# Altium project NixieClock.PrjPcb
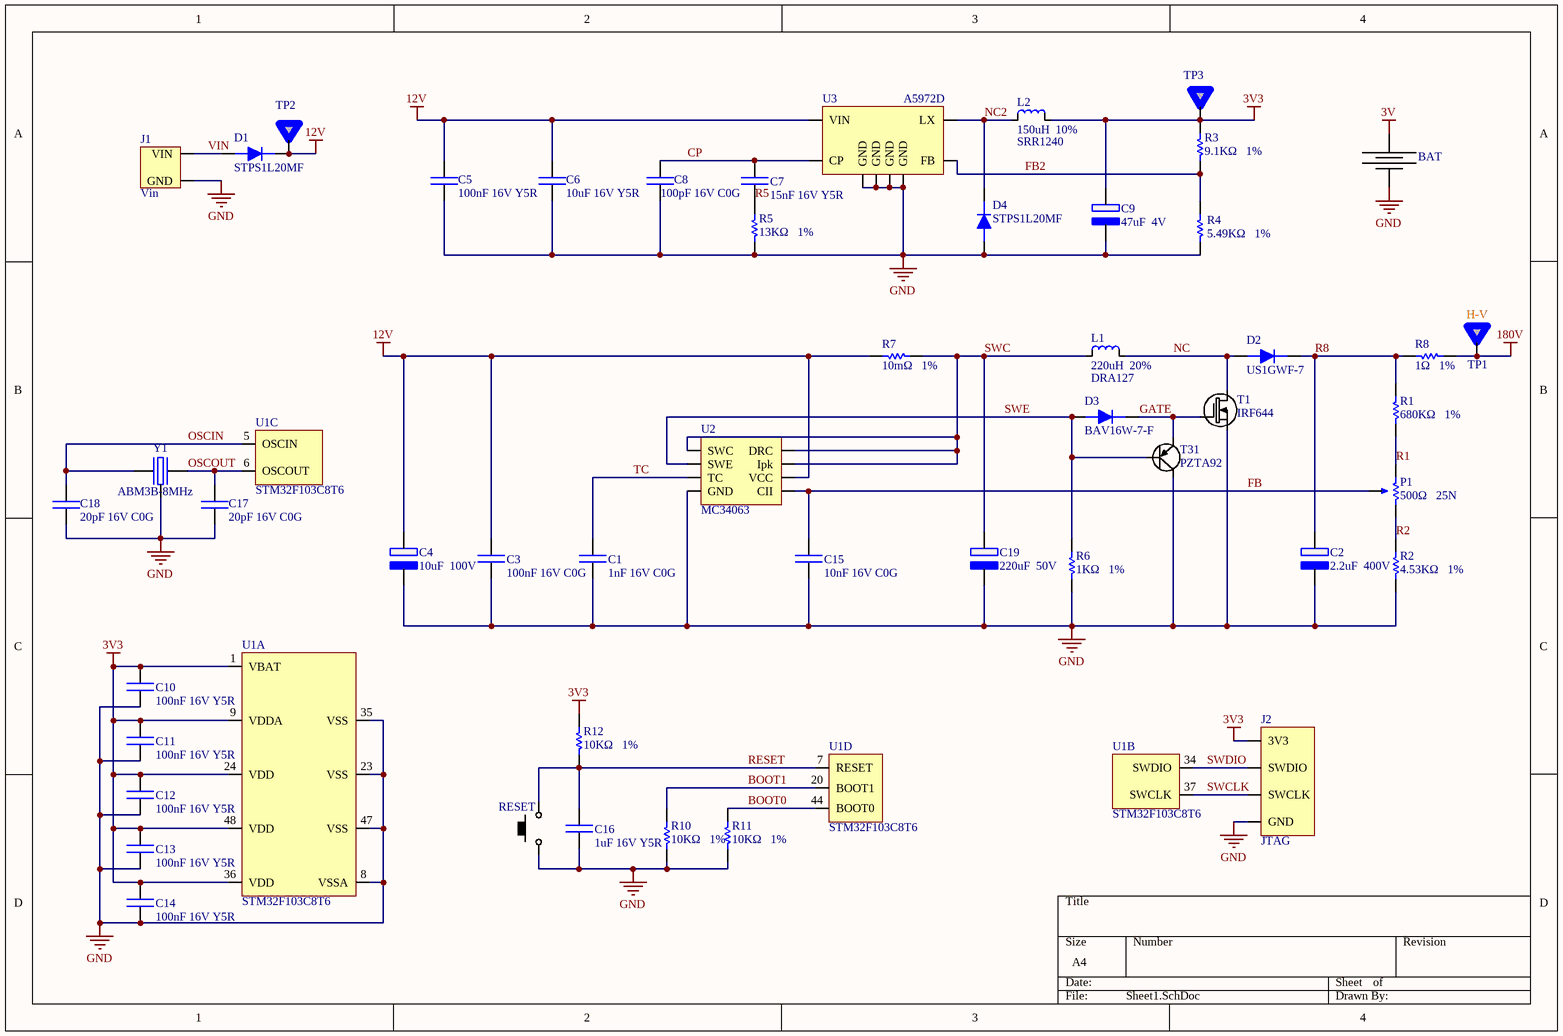
[diagram p0: Sheet1.SchDoc]
3 sheets, 186 parts. Net scope: global (net labels, ports and power ports of the same name join across sheets).
Board file: NixieClock.PcbDoc
Sheets:
  Sheet1.SchDoc
  Sheet2.SchDoc
  Sheet3.SchDoc

## Sheet Sheet1.SchDoc
size A4

### Parts
BAT  3V  [HOLDER-2032]  (value not drawn)
C1  1nF 16V C0G  [0603]
C2  2.2uF  400V  [CAP-SIZE-F]
C3  100nF 16V C0G  [0603]
C4  10uF  100V  [CAP-SIZE-F]
C5  100nF 16V Y5R  [0603]
C6  10uF 16V Y5R  [0603]
C7  15nF 16V Y5R  [0603]
C8  100pF 16V C0G  [0603]
C9  47uF  4V  [AVX-B-CASE]
C10  100nF 16V Y5R  [0603]
C11  100nF 16V Y5R  [0603]
C12  100nF 16V Y5R  [0603]
C13  100nF 16V Y5R  [0603]
C14  100nF 16V Y5R  [0603]
C15  10nF 16V C0G  [0603]
C16  1uF 16V Y5R  [0603]
C17  20pF 16V C0G  [0603]
C18  20pF 16V C0G  [0603]
C19  220uF  50V  [CAP-SIZE-F]
D1  STPS1L20MF  [DO-222AA]
D2  US1GWF-7  [SOD-123F]
D3  BAV16W-7-F  [SOD-123F]
D4  STPS1L20MF  [DO-222AA]
J1  Vin  [BORNERAx2]
J2  JTAG  [PIN-HEADERx4]
L1  220uH  20%  [DRA127]
L2  150uH  10%  [SRR1240]
P1  500Ω   25N  [3296W]
R1  680KΩ   1%  [0603]
R2  4.53KΩ   1%  [0603]
R3  9.1KΩ   1%  [0603]
R4  5.49KΩ   1%  [0603]
R5  13KΩ   1%  [0603]
R6  1KΩ   1%  [0603]
R7  10mΩ   1%  [0603]
R8  1Ω   1%  [0603]
R10  10KΩ   1%  [0603]
R11  10KΩ   1%  [0603]
R12  10KΩ   1%  [0603]
RESET  RESET  [FSMSM]  (value not drawn)
T1  IRF644  [TO263-3S]
T31  PZTA92  [SOT-23]
TP1  HV-TEST-POINT  [Test_Point_HV]  (value not drawn)
TP2  TEST-POINT  [Test_Point]  (value not drawn)
TP3  TEST-POINT  [Test_Point]  (value not drawn)
U1  STM32F103C8T6  [LQFP48]  (parts A,B,C,D of 8)
U2  MC34063  [SOIC-8]
U3  A5972D  [SOIC-8]
Y1  ABM3B-8MHz  [ABM3B]

### Nets
3V: BAT.1(+)
3V3: C9.2 C10.1 C11.1 C12.1 C13.1 C14.1 J2.1(3V3) L2.2 R3.2 R12.2 TP3.1 U1.1(VBAT) U1.9(VDDA) U1.24(VDD) U1.36(VDD) U1.48(VDD)
12V: C3.2 C4.2 C5.2 C6.2 D1.2 R7.1 TP2.1 U2.6(VCC) U3.8(VIN)
180V: R8.2 TP1.1
GND: BAT.2(-) C1.1 C2.1 C3.1 C4.1 C5.1 C6.1 C8.1 C9.1 C10.2 C11.2 C12.2 C13.2 C14.2 C15.1 C16.1 C17.1 C18.1 C19.1 D4.1 J1.2(GND) J2.4(GND) R2.1 R4.2 R5.1 R6.1 R10.1 R11.1 RESET.2 T1.2(S) T31.3(C) U1.8(VSSA) U1.23(VSS) U1.35(VSS) U1.47(VSS) U2.4(GND) U3.2(GND) U3.3(GND) U3.6(GND) U3.7(GND) Y1.3
BOOT0: R11.2 U1.44(BOOT0)
BOOT1: R10.2 U1.20(BOOT1)
CP: C7.2 C8.2 U3.4(CP)
FB: C15.2 P1.2 U2.5(CII)
FB2: R3.1 R4.1 U3.5(FB)
GATE: D3.2 T1.1(G) T31.2(E)
NC: D2.1 L1.2 T1.3(D)
NC2: D4.2 L2.1 U3.1(LX)
OSCIN: C18.2 U1.5(OSCIN) Y1.1
OSCOUT: C17.2 U1.6(OSCOUT) Y1.2
R1: P1.3 R1.1
R2: P1.1 R2.2
R5: C7.1 R5.2
R8: C2.2 D2.2 R1.2 R8.1
RESET: C16.2 R12.1 RESET.1 U1.7(RESET)
SWC: C19.2 L1.1 R7.2 U2.1(SWC) U2.7(Ipk) U2.8(DRC)
SWCLK: J2.3(SWCLK) U1.37(SWCLK)
SWDIO: J2.2(SWDIO) U1.34(SWDIO)
SWE: D3.1 R6.2 T31.1(B) U2.2(SWE)
TC: C1.2 U2.3(TC)
VIN: D1.1 J1.1(VIN)

### Notes on the sheet
- (near L2) SRR1240
- (near L1) DRA127
- (in symbol HV-TEST-POINT) H-V

### Library data of the parts
BAT = BAT
C1 C3 C5-C8 C10-C18 = CAP
C2 C4 C9 C19 = CAP_pol
D1-D4 = DIO
L1 L2 = IND
P1 = POTE
R1-R8 R10-R12 = RES
RESET = BUTTON
T1 = N-MOS
T31 = PNP
Y1 = Cristal

## Sheet Sheet2.SchDoc
size A4
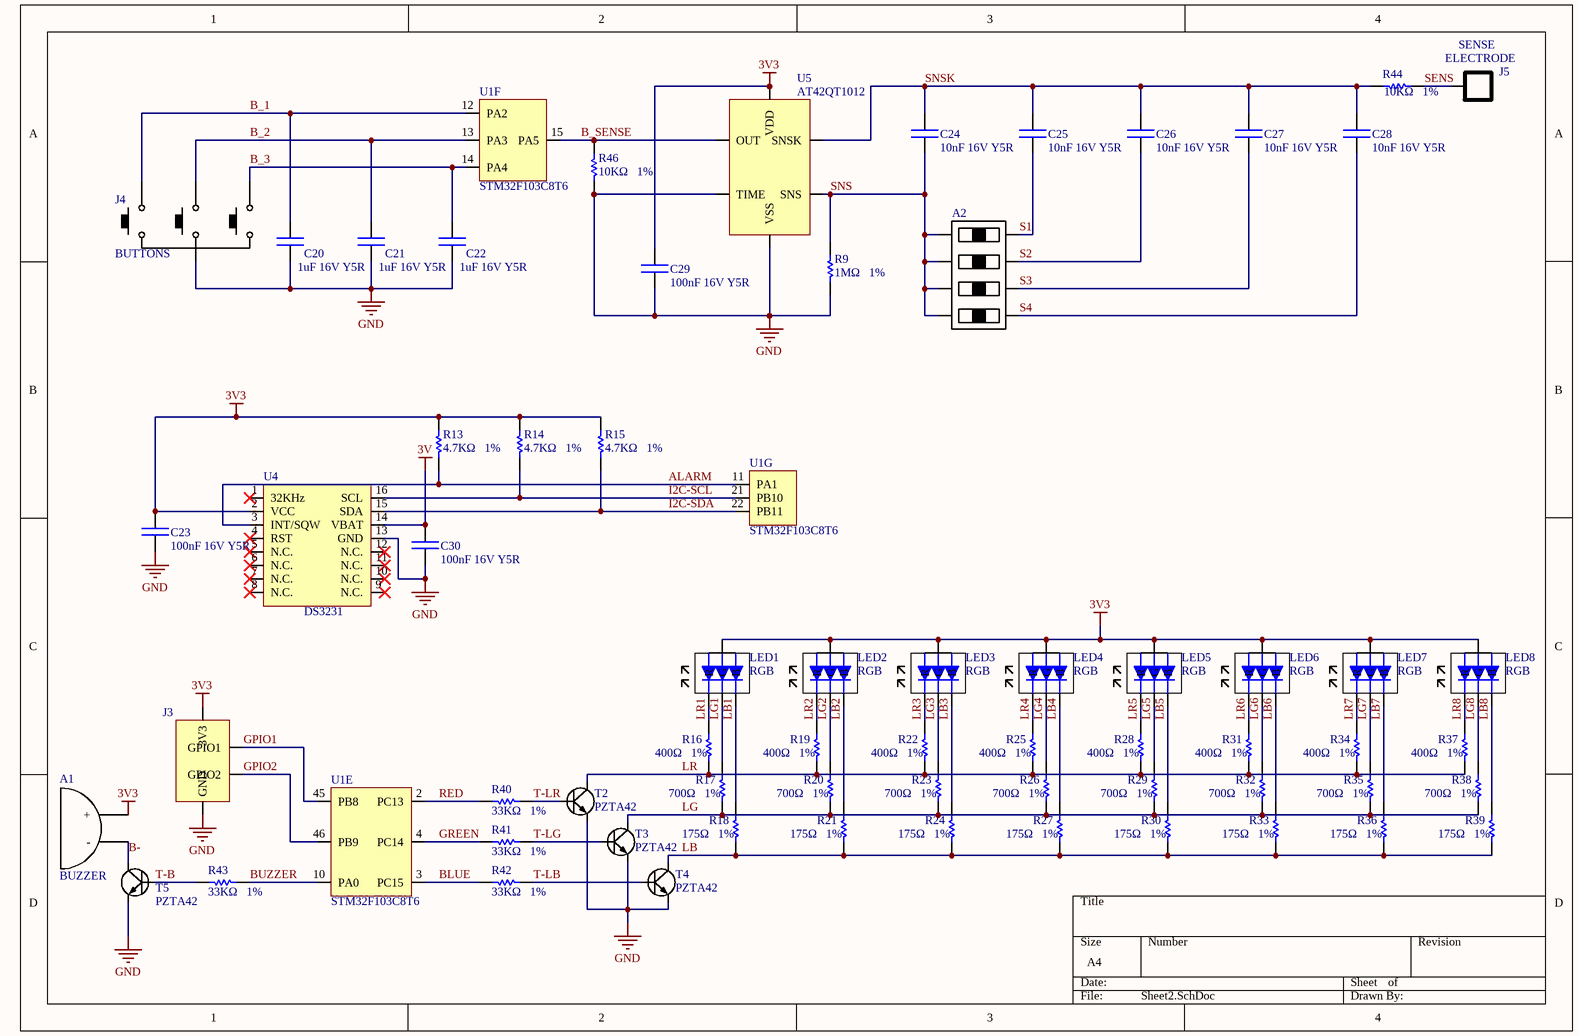
[diagram p1: Sheet2.SchDoc]

### Parts
A1  BUZZER  [BUZZER]
A2  DIP-SWITCHx4  [DIP-SWITCH-X4-J-BEND]  (value not drawn)
C20  1uF 16V Y5R  [0603]
C21  1uF 16V Y5R  [0603]
C22  1uF 16V Y5R  [0603]
C23  100nF 16V Y5R  [0603]
C24  10nF 16V Y5R  [0603]
C25  10nF 16V Y5R  [0603]
C26  10nF 16V Y5R  [0603]
C27  10nF 16V Y5R  [0603]
C28  10nF 16V Y5R  [0603]
C29  100nF 16V Y5R  [0603]
C30  100nF 16V Y5R  [0603]
J3  GPIO  [PIN-HEADERx4-]  (value not drawn)
J4  BUTTONS  [BORNERAx4]
J5  ELECTRODE  [BORNERAx2]
LED1  RGB  [1205-RGB]
LED2  RGB  [1205-RGB]
LED3  RGB  [1205-RGB]
LED4  RGB  [1205-RGB]
LED5  RGB  [1205-RGB]
LED6  RGB  [1205-RGB]
LED7  RGB  [1205-RGB]
LED8  RGB  [1205-RGB]
R9  1MΩ   1%  [0603]
R13  4.7KΩ   1%  [0603]
R14  4.7KΩ   1%  [0603]
R15  4.7KΩ   1%  [0603]
R16  400Ω   1%  [0603]
R17  700Ω   1%  [0603]
R18  175Ω   1%  [0603]
R19  400Ω   1%  [0603]
R20  700Ω   1%  [0603]
R21  175Ω   1%  [0603]
R22  400Ω   1%  [0603]
R23  700Ω   1%  [0603]
R24  175Ω   1%  [0603]
R25  400Ω   1%  [0603]
R26  700Ω   1%  [0603]
R27  175Ω   1%  [0603]
R28  400Ω   1%  [0603]
R29  700Ω   1%  [0603]
R30  175Ω   1%  [0603]
R31  400Ω   1%  [0603]
R32  700Ω   1%  [0603]
R33  175Ω   1%  [0603]
R34  400Ω   1%  [0603]
R35  700Ω   1%  [0603]
R36  175Ω   1%  [0603]
R37  400Ω   1%  [0603]
R38  700Ω   1%  [0603]
R39  175Ω   1%  [0603]
R40  33KΩ   1%  [0603]
R41  33KΩ   1%  [0603]
R42  33KΩ   1%  [0603]
R43  33KΩ   1%  [0603]
R44  10KΩ   1%  [0603]
R46  10KΩ   1%  [0603]
T2  PZTA42  [SOT-23]
T3  PZTA42  [SOT-23]
T4  PZTA42  [SOT-23]
T5  PZTA42  [SOT-23]
U1  STM32F103C8T6  [LQFP48]  (parts E,F,G of 8)
U4  DS3231  [SO16W]
U5  AT42QT1012  [SOT-23-6]

### Nets
3V: C30.2 U4.14(VBAT)
3V3: A1.1(+) C23.2 C29.1 J3.1(3V3) LED1.2(A) LED2.2(A) LED3.2(A) LED4.2(A) LED5.2(A) LED6.2(A) LED7.2(A) LED8.2(A) R13.2 R14.2 R15.2 U4.2(VCC) U5.5(VDD)
GND: C20.1 C21.1 C22.1 C23.1 C29.2 C30.1 J3.4(GND) J4.4 R9.2 R46.1 T2.2(E) T3.2(E) T4.2(E) T5.2(E) U4.13(GND) U5.2(VSS) U5.6(TIME)
ALARM: R13.1 U1.11(PA1) U4.3(INT/SQW)
B-: A1.2(-) T5.3(C)
B_1: C20.2 J4.1 U1.12(PA2)
B_2: C21.2 J4.2 U1.13(PA3)
B_3: C22.2 J4.3 U1.14(PA4)
B_SENSE: R46.2 U1.15(PA5) U5.1(OUT)
BLUE: R42.1 U1.3(PC15)
BUZZER: R43.2 U1.10(PA0)
GPIO1: J3.2(GPIO1) U1.45(PB8)
GPIO2: J3.3(GPIO2) U1.46(PB9)
GREEN: R41.1 U1.4(PC14)
I2C-SCL: R14.1 U1.21(PB10) U4.16(SCL)
I2C-SDA: R15.1 U1.22(PB11) U4.15(SDA)
LB: R18.1 R21.1 R24.1 R27.1 R30.1 R33.1 R36.1 R39.1 T4.3(C)
LB1: LED1.3(B) R18.2
LB2: LED2.3(B) R21.2
LB3: LED3.3(B) R24.2
LB4: LED4.3(B) R27.2
LB5: LED5.3(B) R30.2
LB6: LED6.3(B) R33.2
LB7: LED7.3(B) R36.2
LB8: LED8.3(B) R39.2
LG: R17.1 R20.1 R23.1 R26.1 R29.1 R32.1 R35.1 R38.1 T3.3(C)
LG1: LED1.4(G) R17.2
LG2: LED2.4(G) R20.2
LG3: LED3.4(G) R23.2
LG4: LED4.4(G) R26.2
LG5: LED5.4(G) R29.2
LG6: LED6.4(G) R32.2
LG7: LED7.4(G) R35.2
LG8: LED8.4(G) R38.2
LR: R16.1 R19.1 R22.1 R25.1 R28.1 R31.1 R34.1 R37.1 T2.3(C)
LR1: LED1.1(R) R16.2
LR2: LED2.1(R) R19.2
LR3: LED3.1(R) R22.2
LR4: LED4.1(R) R25.2
LR5: LED5.1(R) R28.2
LR6: LED6.1(R) R31.2
LR7: LED7.1(R) R34.2
LR8: LED8.1(R) R37.2
RED: R40.1 U1.2(PC13)
S1: A2.8 C25.2
S2: A2.7 C26.2
S3: A2.6 C27.2
S4: A2.5 C28.2
SENS: J5.1 R44.1
SNS: A2.1 A2.2 A2.3 A2.4 C24.2 R9.1 U5.4(SNS)
SNSK: C24.1 C25.1 C26.1 C27.1 C28.1 R44.2 U5.3(SNSK)
T-B: R43.1 T5.1(B)
T-LB: R42.2 T4.1(B)
T-LG: R41.2 T3.1(B)
T-LR: R40.2 T2.1(B)

Not connected (* = marked no-connect by the designer): U4 1(32KHz)* 4(RST)* 5(N.C.)* 6(N.C.)* 7(N.C.)* 8(N.C.)* 9(N.C.)* 10(N.C.)* 11(N.C.)* 12(N.C.)*

### Notes on the sheet
- (near J5) SENSE

### Library data of the parts
C20-C30 = CAP
J4 = BUTTONx3
R9 R13-R44 R46 = RES
T2-T5 = NPN

## Sheet Sheet3.SchDoc
size A4
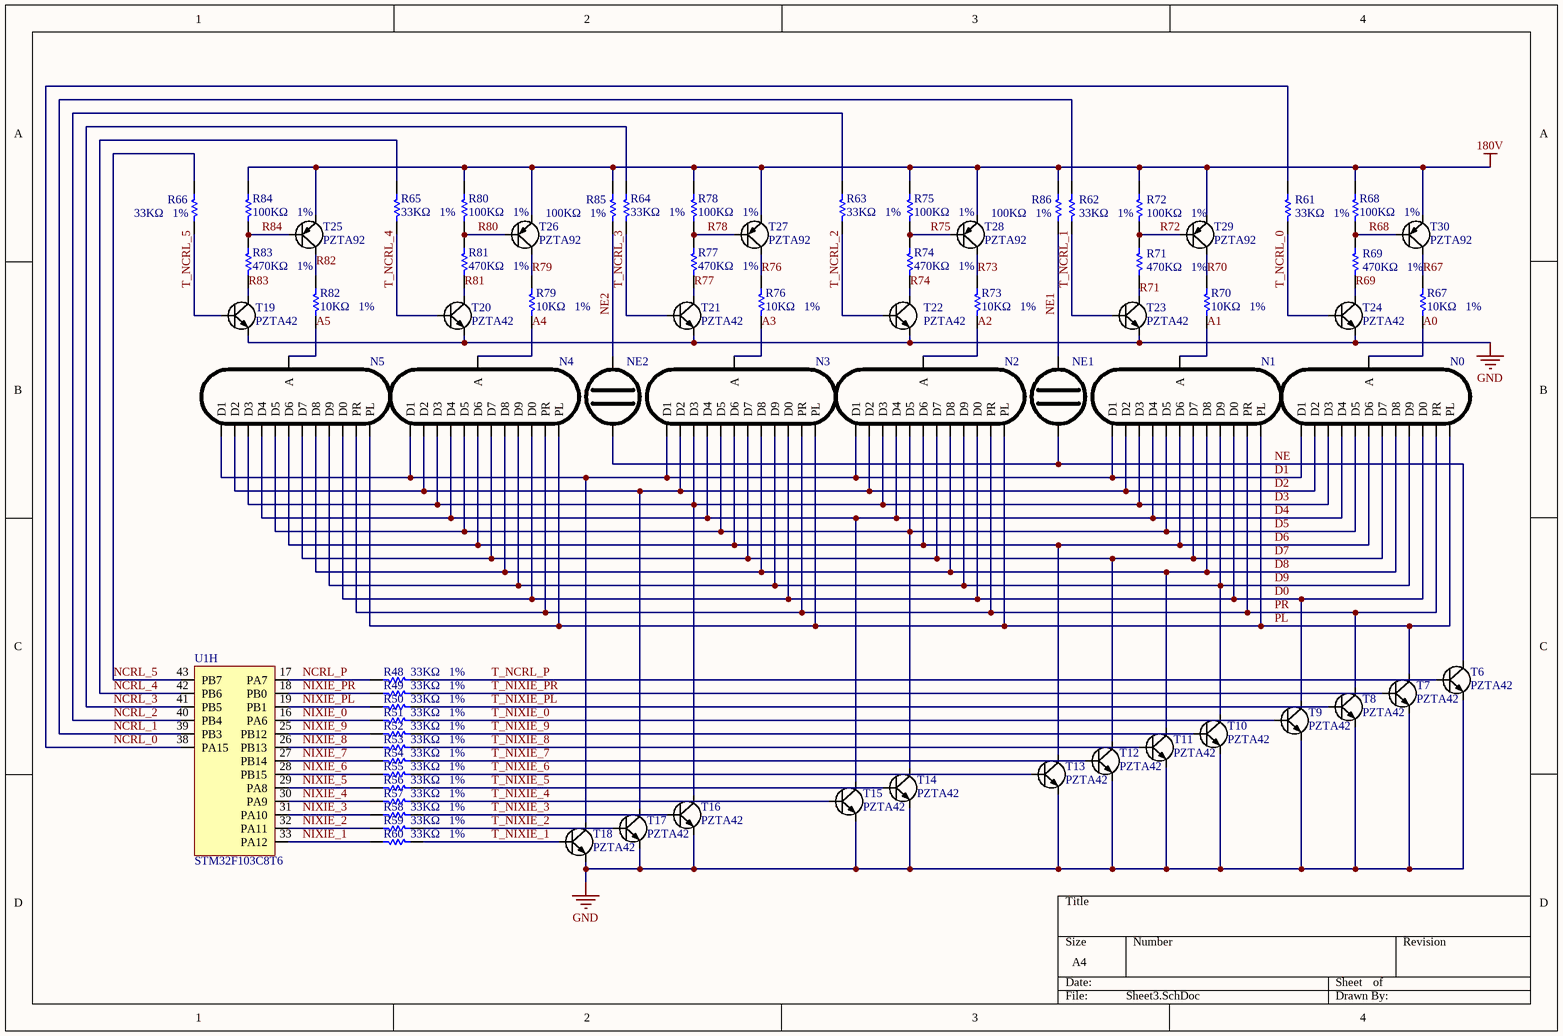
[diagram p2: Sheet3.SchDoc]

### Parts
N0  NIXIE-IN14  [NIXIE_IN-14]  (value not drawn)
N1  NIXIE-IN14  [NIXIE_IN-14]  (value not drawn)
N2  NIXIE-IN14  [NIXIE_IN-14]  (value not drawn)
N3  NIXIE-IN14  [NIXIE_IN-14]  (value not drawn)
N4  NIXIE-IN14  [NIXIE_IN-14]  (value not drawn)
N5  NIXIE-IN14  [NIXIE_IN-14]  (value not drawn)
NE1  NEON-LAMP  [NIXIE_IN-3]  (value not drawn)
NE2  NEON-LAMP  [NIXIE_IN-3]  (value not drawn)
R48  33KΩ   1%  [0603]
R49  33KΩ   1%  [0603]
R50  33KΩ   1%  [0603]
R51  33KΩ   1%  [0603]
R52  33KΩ   1%  [0603]
R53  33KΩ   1%  [0603]
R54  33KΩ   1%  [0603]
R55  33KΩ   1%  [0603]
R56  33KΩ   1%  [0603]
R57  33KΩ   1%  [0603]
R58  33KΩ   1%  [0603]
R59  33KΩ   1%  [0603]
R60  33KΩ   1%  [0603]
R61  33KΩ   1%  [0603]
R62  33KΩ   1%  [0603]
R63  33KΩ   1%  [0603]
R64  33KΩ   1%  [0603]
R65  33KΩ   1%  [0603]
R66  33KΩ   1%  [0603]
R67  10KΩ   1%  [0603]
R68  100KΩ   1%  [0603]
R69  470KΩ   1%  [0603]
R70  10KΩ   1%  [0603]
R71  470KΩ   1%  [0603]
R72  100KΩ   1%  [0603]
R73  10KΩ   1%  [0603]
R74  470KΩ   1%  [0603]
R75  100KΩ   1%  [0603]
R76  10KΩ   1%  [0603]
R77  470KΩ   1%  [0603]
R78  100KΩ   1%  [0603]
R79  10KΩ   1%  [0603]
R80  100KΩ   1%  [0603]
R81  470KΩ   1%  [0603]
R82  10KΩ   1%  [0603]
R83  470KΩ   1%  [0603]
R84  100KΩ   1%  [0603]
R85  100KΩ   1%  [0603]
R86  100KΩ   1%  [0603]
T6  PZTA42  [SOT-23]
T7  PZTA42  [SOT-23]
T8  PZTA42  [SOT-23]
T9  PZTA42  [SOT-23]
T10  PZTA42  [SOT-23]
T11  PZTA42  [SOT-23]
T12  PZTA42  [SOT-23]
T13  PZTA42  [SOT-23]
T14  PZTA42  [SOT-23]
T15  PZTA42  [SOT-23]
T16  PZTA42  [SOT-23]
T17  PZTA42  [SOT-23]
T18  PZTA42  [SOT-23]
T19  PZTA42  [SOT-23]
T20  PZTA42  [SOT-23]
T21  PZTA42  [SOT-23]
T22  PZTA42  [SOT-23]
T23  PZTA42  [SOT-23]
T24  PZTA42  [SOT-23]
T25  PZTA92  [SOT-23]
T26  PZTA92  [SOT-23]
T27  PZTA92  [SOT-23]
T28  PZTA92  [SOT-23]
T29  PZTA92  [SOT-23]
T30  PZTA92  [SOT-23]
U1  STM32F103C8T6  [LQFP48]  (part H of 8)

### Nets
180V: R68.2 R72.2 R75.2 R78.2 R80.2 R84.2 R85.2 R86.2 T25.2(E) T26.2(E) T27.2(E) T28.2(E) T29.2(E) T30.2(E)
GND: T6.2(E) T7.2(E) T8.2(E) T9.2(E) T10.2(E) T11.2(E) T12.2(E) T13.2(E) T14.2(E) T15.2(E) T16.2(E) T17.2(E) T18.2(E) T19.2(E) T20.2(E) T21.2(E) T22.2(E) T23.2(E) T24.2(E)
A0: N0.1(A) R67.1
A1: N1.1(A) R70.1
A2: N2.1(A) R73.1
A3: N3.1(A) R76.1
A4: N4.1(A) R79.1
A5: N5.1(A) R82.1
D0: N0.12(D0) N1.12(D0) N2.12(D0) N3.12(D0) N4.12(D0) N5.12(D0) T9.3(C)
D1: N0.3(D1) N1.3(D1) N2.3(D1) N3.3(D1) N4.3(D1) N5.3(D1) T18.3(C)
D2: N0.4(D2) N1.4(D2) N2.4(D2) N3.4(D2) N4.4(D2) N5.4(D2) T17.3(C)
D3: N0.5(D3) N1.5(D3) N2.5(D3) N3.5(D3) N4.5(D3) N5.5(D3) T16.3(C)
D4: N0.6(D4) N1.6(D4) N2.6(D4) N3.6(D4) N4.6(D4) N5.6(D4) T15.3(C)
D5: N0.7(D5) N1.7(D5) N2.7(D5) N3.7(D5) N4.7(D5) N5.7(D5) T14.3(C)
D6: N0.8(D6) N1.8(D6) N2.8(D6) N3.8(D6) N4.8(D6) N5.8(D6) T13.3(C)
D7: N0.9(D7) N1.9(D7) N2.9(D7) N3.9(D7) N4.9(D7) N5.9(D7) T12.3(C)
D8: N0.10(D8) N1.10(D8) N2.10(D8) N3.10(D8) N4.10(D8) N5.10(D8) T11.3(C)
D9: N0.11(D9) N1.11(D9) N2.11(D9) N3.11(D9) N4.11(D9) N5.11(D9) T10.3(C)
NCRL_0: R61.1 U1.38(PA15)
NCRL_1: R62.2 U1.39(PB3)
NCRL_2: R63.2 U1.40(PB4)
NCRL_3: R64.1 U1.41(PB5)
NCRL_4: R65.2 U1.42(PB6)
NCRL_5: R66.2 U1.43(PB7)
NCRL_P: R48.1 U1.17(PA7)
NE: NE1.2 NE2.2 T6.3(C)
NE1: NE1.1 R86.1
NE2: NE2.1 R85.1
NIXIE_0: R51.1 U1.16(PA6)
NIXIE_1: R60.1 U1.33(PA12)
NIXIE_2: R59.1 U1.32(PA11)
NIXIE_3: R58.1 U1.31(PA10)
NIXIE_4: R57.1 U1.30(PA9)
NIXIE_5: R56.1 U1.29(PA8)
NIXIE_6: R55.1 U1.28(PB15)
NIXIE_7: R54.1 U1.27(PB14)
NIXIE_8: R53.1 U1.26(PB13)
NIXIE_9: R52.1 U1.25(PB12)
NIXIE_PL: R50.1 U1.19(PB1)
NIXIE_PR: R49.1 U1.18(PB0)
PL: N0.2(PL) N1.2(PL) N2.2(PL) N3.2(PL) N4.2(PL) N5.2(PL) T7.3(C)
PR: N0.13(PR) N1.13(PR) N2.13(PR) N3.13(PR) N4.13(PR) N5.13(PR) T8.3(C)
R67: R67.2 T30.3(C)
R68: R68.1 R69.2 T30.1(B)
R69: R69.1 T24.3(C)
R70: R70.2 T29.3(C)
R71: R71.1 T23.3(C)
R72: R71.2 R72.1 T29.1(B)
R73: R73.2 T28.3(C)
R74: R74.1 T22.3(C)
R75: R74.2 R75.1 T28.1(B)
R76: R76.2 T27.3(C)
R77: R77.1 T21.3(C)
R78: R77.2 R78.1 T27.1(B)
R79: R79.2 T26.3(C)
R80: R80.1 R81.2 T26.1(B)
R81: R81.1 T20.3(C)
R82: R82.2 T25.3(C)
R83: R83.1 T19.3(C)
R84: R83.2 R84.1 T25.1(B)
T_NCRL_0: R61.2 T24.1(B)
T_NCRL_1: R62.1 T23.1(B)
T_NCRL_2: R63.1 T22.1(B)
T_NCRL_3: R64.2 T21.1(B)
T_NCRL_4: R65.1 T20.1(B)
T_NCRL_5: R66.1 T19.1(B)
T_NCRL_P: R48.2 T6.1(B)
T_NIXIE_0: R51.2 T9.1(B)
T_NIXIE_1: R60.2 T18.1(B)
T_NIXIE_2: R59.2 T17.1(B)
T_NIXIE_3: R58.2 T16.1(B)
T_NIXIE_4: R57.2 T15.1(B)
T_NIXIE_5: R56.2 T14.1(B)
T_NIXIE_6: R55.2 T13.1(B)
T_NIXIE_7: R54.2 T12.1(B)
T_NIXIE_8: R53.2 T11.1(B)
T_NIXIE_9: R52.2 T10.1(B)
T_NIXIE_PL: R50.2 T8.1(B)
T_NIXIE_PR: R49.2 T7.1(B)

### Library data of the parts
R48-R86 = RES
T6-T24 = NPN
T25-T30 = PNP

## Nets that join several sheets
3V: Sheet1 (BAT.1), Sheet2 (C30.2 U4.14)
3V3: Sheet1 (16 pins), Sheet2 (17 pins)
180V: Sheet1 (R8.2 TP1.1), Sheet3 (14 pins)
GND: Sheet1 (41 pins), Sheet2 (17 pins), Sheet3 (19 pins)